# Altium schematic sheet Jukebox Power.SchDoc: Jukebox Power
size B; DrawnBy: Tim Menninger; Revision: 1.1; SheetNumber: 5; SheetTotal: 5
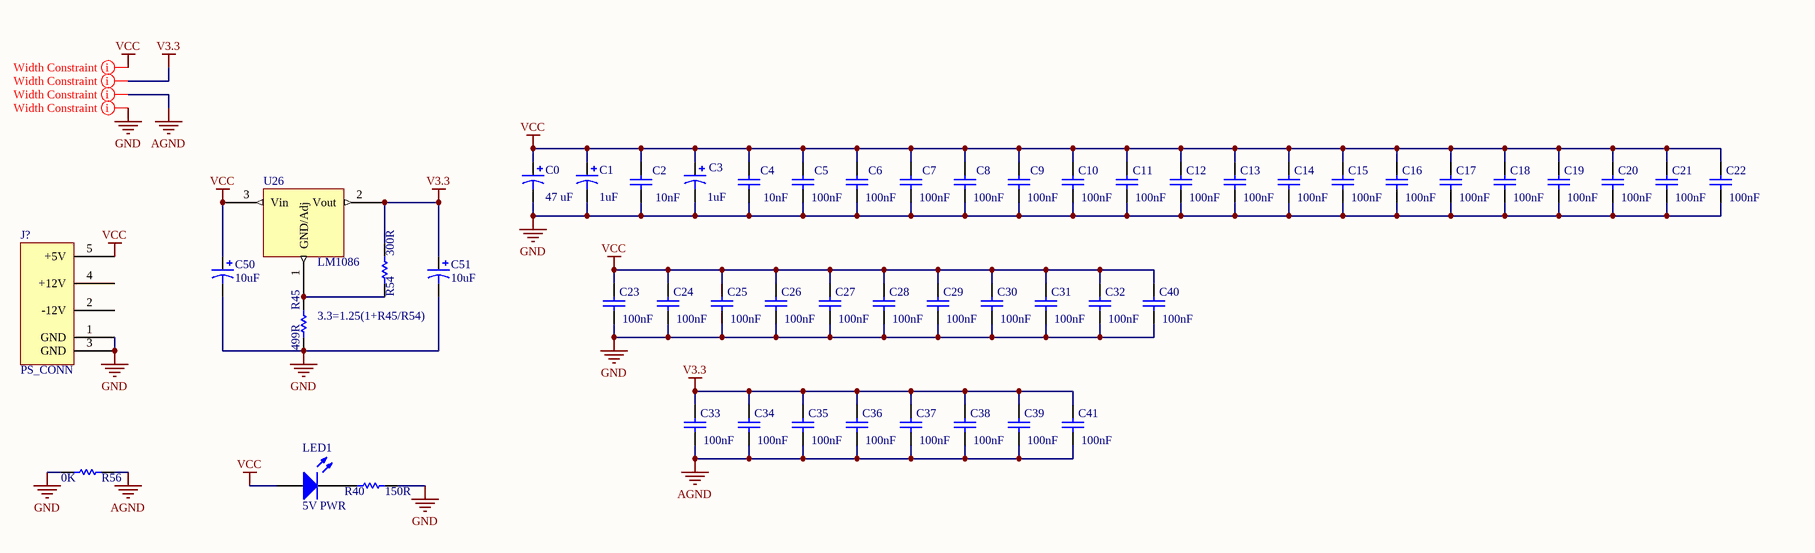
[diagram p0: Jukebox Power.SchDoc]

## Parts
C0  value 47 uF  [RB.1/.2]  (hidden comment: Cap Pol3)
C1  value 1uF  [C0805]  (hidden comment: Cap Pol3)
C2  value 10nF  [C0805]  (hidden comment: Cap)
C3  value 1uF  [C0805]  (hidden comment: Cap Pol3)
C4  value 10nF  [C0805]  (hidden comment: Cap)
C5  value 100nF  [C0805]  (hidden comment: Cap)
C6  value 100nF  [C0805]  (hidden comment: Cap)
C7  value 100nF  [C0805]  (hidden comment: Cap)
C8  value 100nF  [C0805]  (hidden comment: Cap)
C9  value 100nF  [C0805]  (hidden comment: Cap)
C10  value 100nF  [C0805]  (hidden comment: Cap)
C11  value 100nF  [C0805]  (hidden comment: Cap)
C12  value 100nF  [C0805]  (hidden comment: Cap)
C13  value 100nF  [C0805]  (hidden comment: Cap)
C14  value 100nF  [C0805]  (hidden comment: Cap)
C15  value 100nF  [C0805]  (hidden comment: Cap)
C16  value 100nF  [C0805]  (hidden comment: Cap)
C17  value 100nF  [C0805]  (hidden comment: Cap)
C18  value 100nF  [C0805]  (hidden comment: Cap)
C19  value 100nF  [C0805]  (hidden comment: Cap)
C20  value 100nF  [C0805]  (hidden comment: Cap)
C21  value 100nF  [C0805]  (hidden comment: Cap)
C22  value 100nF  [C0805]  (hidden comment: Cap)
C23  value 100nF  [C0805]  (hidden comment: Cap)
C24  value 100nF  [C0805]  (hidden comment: Cap)
C25  value 100nF  [C0805]  (hidden comment: Cap)
C26  value 100nF  [C0805]  (hidden comment: Cap)
C27  value 100nF  [C0805]  (hidden comment: Cap)
C28  value 100nF  [C0805]  (hidden comment: Cap)
C29  value 100nF  [C0805]  (hidden comment: Cap)
C30  value 100nF  [C0805]  (hidden comment: Cap)
C31  value 100nF  [C0805]  (hidden comment: Cap)
C32  value 100nF  [C0805]  (hidden comment: Cap)
C33  value 100nF  [C0805]  (hidden comment: Cap)
C34  value 100nF  [C0805]  (hidden comment: Cap)
C35  value 100nF  [C0805]  (hidden comment: Cap)
C36  value 100nF  [C0805]  (hidden comment: Cap)
C37  value 100nF  [C0805]  (hidden comment: Cap)
C38  value 100nF  [C0805]  (hidden comment: Cap)
C39  value 100nF  [C0805]  (hidden comment: Cap)
C40  value 100nF  [C0805]  (hidden comment: Cap)
C41  value 100nF  [C0805]  (hidden comment: Cap)
C50  value 10uF  [C0805]  (hidden comment: Cap Pol3)
C51  value 10uF  [C0805]  (hidden comment: Cap Pol3)
J?  PS_CONN  [DIN5]
LED1  5V PWR  [3.2X1.6X1.1]
R40  value 150R  [6-0805_L]  (hidden comment: Res1)
R45  value 499R  [6-0805_L]  (hidden comment: Res1)
R54  value 300R  [6-0805_L]  (hidden comment: Res1)
R56  value 0K  [6-0805_L]  (hidden comment: Res1)
U26  LM1086  [TO-220]

## Nets
AGND: C33.1 C34.1 C35.1 C36.1 C37.1 C38.1 C39.1 C41.1 R56.1
GND: C0.2 C1.2 C2.1 C3.2 C4.1 C5.1 C6.1 C7.1 C8.1 C9.1 C10.1 C11.1 C12.1 C13.1 C14.1 C15.1 C16.1 C17.1 C18.1 C19.1 C20.1 C21.1 C22.1 C23.1 C24.1 C25.1 C26.1 C27.1 C28.1 C29.1 C30.1 C31.1 C32.1 C40.1 C50.2 C51.2 J?.1(GND) J?.3(GND) R40.1 R45.2 R56.2
V3.3: C33.2 C34.2 C35.2 C36.2 C37.2 C38.2 C39.2 C41.2 C51.1 R54.2 U26.2(Vout)
VCC: C0.1 C1.1 C2.2 C3.1 C4.2 C5.2 C6.2 C7.2 C8.2 C9.2 C10.2 C11.2 C12.2 C13.2 C14.2 C15.2 C16.2 C17.2 C18.2 C19.2 C20.2 C21.2 C22.2 C23.2 C24.2 C25.2 C26.2 C27.2 C28.2 C29.2 C30.2 C31.2 C32.2 C40.2 C50.1 J?.5(+5V) LED1.1(A) U26.3(Vin)
NetLED1_2: LED1.2(K) R40.2
NetR45_1: R45.1 R54.1 U26.1(GND/Adj)

Not connected (* = marked no-connect by the designer): J? 2(-12V) 4(+12V)

## Layout directives
rule Width Constraint [Pref Width = 30mil    Min Width = 8mil    Max Width = 30mil]: AGND, GND, V3.3, VCC

## Notes on the sheet
- (near R45) 3.3=1.25(1+R45/R54)
- Labels drawn without touching a wire or pin: GND, VCC

## Library data of the parts
C0 C1 C3 C50 C51 = Cap Pol3: Polarized Capacitor (Surface Mount); Published: 8-Jun-2000; LatestRevisionDate: 29-May-2009; LatestRevisionNote: IPC-7351 Footprint Added.; PackageReference: C0805; Publisher: Altium Limited; PackageDescription: Chip Capacitor
C2 C4-C41 = Cap: Capacitor; Published: 8-Jun-2000; LatestRevisionDate: 17-Jul-2002; LatestRevisionNote: Re-released for DXP Platform.; PackageReference: RAD-0.3; Publisher: Altium Limited; PackageDescription: Radial Cap, Thru-Hole; 2 Leads; 0.3 in Pin Spacing
J? = PS_CONN: Elpac Compatible Power Supply Connector
LED1 = LED2: Typical RED, GREEN, YELLOW, AMBER GaAs LED; Published: 8-Jun-2000; LatestRevisionDate: 17-Jul-2002; LatestRevisionNote: Re-released for DXP Platform.; PackageVersion: Feb-2002; PackageReference: 3.2X1.6X1.1; Publisher: Altium Limited; PackageDescription: SM LED; 2 Flat Leads
R40 R45 R54 R56 = Res1: Resistor; Published: 8-Jun-2000; LatestRevisionDate: 17-Jul-2002; LatestRevisionNote: Re-released for DXP Platform.; PackageReference: AXIAL-0.3; Publisher: Altium Limited; PackageDescription: Axial Device, Thru-Hole; 2 Leads; 0.3 in Pin Spacing
U26 = LM1086: 1.5A Low Dropout Positive Regulator